# Altium schematic sheet CFD.SchDoc: CFD
size A3; Author: M.Beldyga; CompanyName: WUT ISE; DrawnBy: M.Beldyga; Organization: WUT ISE; Address1: PW ISE; Address2: Nowowiejska 15/19 00-665 Warsaw; Address3: micbeldyga@gmail.com; SheetNumber: 2; SheetTotal: 3; ModifiedBy: -; CheckedDate: -; Title2: MODULIQ; DivGrp: WUT ISE; Designer: M.Beldyga; ModifiedDate: -; ProjectName: Sensor Box
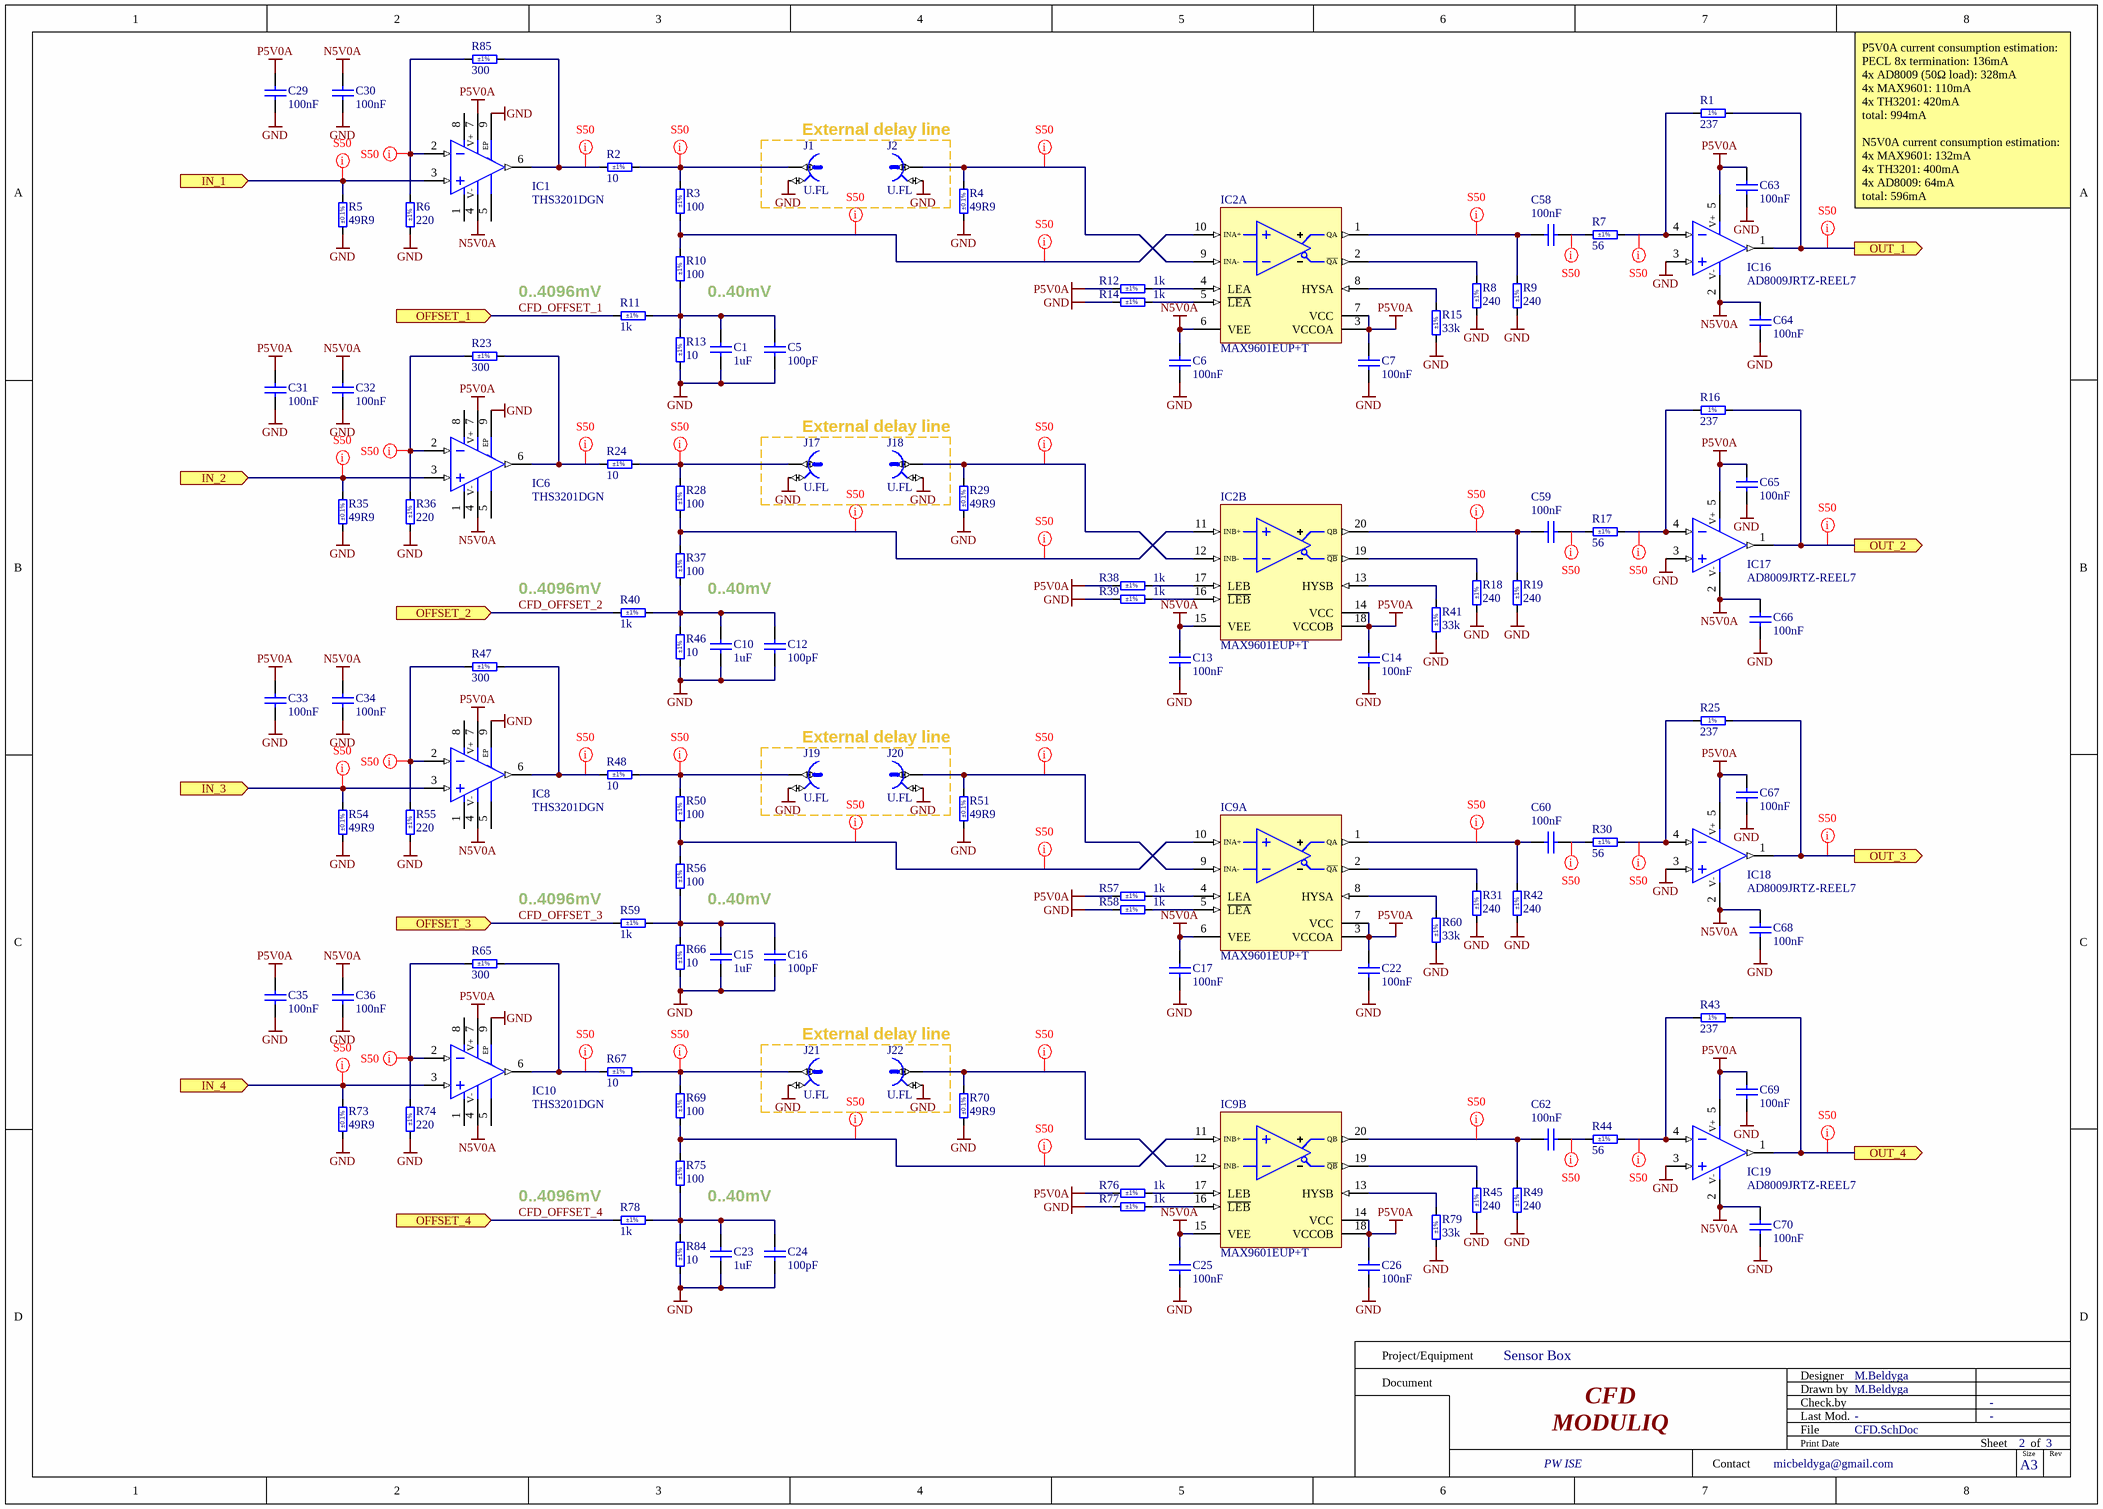
[diagram p0: CFD.SchDoc]

## Parts
C1  1uF  [CAPC1005X55N]
C5  100pF  [CAPC1005X55N]
C6  100nF  [CAPC1005X55N]
C7  100nF  [CAPC1005X55N]
C10  1uF  [CAPC1005X55N]
C12  100pF  [CAPC1005X55N]
C13  100nF  [CAPC1005X55N]
C14  100nF  [CAPC1005X55N]
C15  1uF  [CAPC1005X55N]
C16  100pF  [CAPC1005X55N]
C17  100nF  [CAPC1005X55N]
C22  100nF  [CAPC1005X55N]
C23  1uF  [CAPC1005X55N]
C24  100pF  [CAPC1005X55N]
C25  100nF  [CAPC1005X55N]
C26  100nF  [CAPC1005X55N]
C29  100nF  [CAPC1005X55N]
C30  100nF  [CAPC1005X55N]
C31  100nF  [CAPC1005X55N]
C32  100nF  [CAPC1005X55N]
C33  100nF  [CAPC1005X55N]
C34  100nF  [CAPC1005X55N]
C35  100nF  [CAPC1005X55N]
C36  100nF  [CAPC1005X55N]
C58  100nF  [CAPC1005X55N]
C59  100nF  [CAPC1005X55N]
C60  100nF  [CAPC1005X55N]
C62  100nF  [CAPC1005X55N]
C63  100nF  [CAPC1005X55N]
C64  100nF  [CAPC1005X55N]
C65  100nF  [CAPC1005X55N]
C66  100nF  [CAPC1005X55N]
C67  100nF  [CAPC1005X55N]
C68  100nF  [CAPC1005X55N]
C69  100nF  [CAPC1005X55N]
C70  100nF  [CAPC1005X55N]
IC1  THS3201DGN  [SOP65P490X110-9N-R152X190]
IC2  MAX9601EUP+T  [SOP65P640X120-20N]  (parts A,B of 2)
IC6  THS3201DGN  [SOP65P490X110-9N-R152X190]
IC8  THS3201DGN  [SOP65P490X110-9N-R152X190]
IC9  MAX9601EUP+T  [SOP65P640X120-20N]  (parts A,B of 2)
IC10  THS3201DGN  [SOP65P490X110-9N-R152X190]
IC16  AD8009JRTZ-REEL7  [SOT95P280X145-5N]
IC17  AD8009JRTZ-REEL7  [SOT95P280X145-5N]
IC18  AD8009JRTZ-REEL7  [SOT95P280X145-5N]
IC19  AD8009JRTZ-REEL7  [SOT95P280X145-5N]
J1  U.FL  [HIROSE_U.FL-R-SMT-1]
J2  U.FL  [HIROSE_U.FL-R-SMT-1]
J17  U.FL  [HIROSE_U.FL-R-SMT-1]
J18  U.FL  [HIROSE_U.FL-R-SMT-1]
J19  U.FL  [HIROSE_U.FL-R-SMT-1]
J20  U.FL  [HIROSE_U.FL-R-SMT-1]
J21  U.FL  [HIROSE_U.FL-R-SMT-1]
J22  U.FL  [HIROSE_U.FL-R-SMT-1]
R1  237  [RESC1005X40N]
R2  10  Tolerance: ±1%  [RESC1005X40N]
R3  100  Tolerance: ±1%  [RESC1005X40N]
R4  49R9  Tolerance: ±0.1%  [RESC2012X60N]
R5  49R9  Tolerance: ±0.1%  [RESC2012X60N]
R6  220  Tolerance: ±1%  [RESC1005X40N]
R7  56  Tolerance: ±1%  [RESC1005X40N]
R8  240  Tolerance: ±1%  [RESC1608X55N]
R9  240  Tolerance: ±1%  [RESC1608X55N]
R10  100  Tolerance: ±1%  [RESC1005X40N]
R11  1k  Tolerance: ±1%  [RESC1005X40N]
R12  1k  Tolerance: ±1%  [RESC1005X40N]
R13  10  Tolerance: ±1%  [RESC1005X40N]
R14  1k  Tolerance: ±1%  [RESC1005X40N]
R15  33k  Tolerance: ±1%  [RESC1005X40N]
R16  237  [RESC1005X40N]
R17  56  Tolerance: ±1%  [RESC1005X40N]
R18  240  Tolerance: ±1%  [RESC1608X55N]
R19  240  Tolerance: ±1%  [RESC1608X55N]
R23  300  Tolerance: ±1%  [RESC1005X40N]
R24  10  Tolerance: ±1%  [RESC1005X40N]
R25  237  [RESC1005X40N]
R28  100  Tolerance: ±1%  [RESC1005X40N]
R29  49R9  Tolerance: ±0.1%  [RESC2012X60N]
R30  56  Tolerance: ±1%  [RESC1005X40N]
R31  240  Tolerance: ±1%  [RESC1608X55N]
R35  49R9  Tolerance: ±0.1%  [RESC2012X60N]
R36  220  Tolerance: ±1%  [RESC1005X40N]
R37  100  Tolerance: ±1%  [RESC1005X40N]
R38  1k  Tolerance: ±1%  [RESC1005X40N]
R39  1k  Tolerance: ±1%  [RESC1005X40N]
R40  1k  Tolerance: ±1%  [RESC1005X40N]
R41  33k  Tolerance: ±1%  [RESC1005X40N]
R42  240  Tolerance: ±1%  [RESC1608X55N]
R43  237  [RESC1005X40N]
R44  56  Tolerance: ±1%  [RESC1005X40N]
R45  240  Tolerance: ±1%  [RESC1608X55N]
R46  10  Tolerance: ±1%  [RESC1005X40N]
R47  300  Tolerance: ±1%  [RESC1005X40N]
R48  10  Tolerance: ±1%  [RESC1005X40N]
R49  240  Tolerance: ±1%  [RESC1608X55N]
R50  100  Tolerance: ±1%  [RESC1005X40N]
R51  49R9  Tolerance: ±0.1%  [RESC2012X60N]
R54  49R9  Tolerance: ±0.1%  [RESC2012X60N]
R55  220  Tolerance: ±1%  [RESC1005X40N]
R56  100  Tolerance: ±1%  [RESC1005X40N]
R57  1k  Tolerance: ±1%  [RESC1005X40N]
R58  1k  Tolerance: ±1%  [RESC1005X40N]
R59  1k  Tolerance: ±1%  [RESC1005X40N]
R60  33k  Tolerance: ±1%  [RESC1005X40N]
R65  300  Tolerance: ±1%  [RESC1005X40N]
R66  10  Tolerance: ±1%  [RESC1005X40N]
R67  10  Tolerance: ±1%  [RESC1005X40N]
R69  100  Tolerance: ±1%  [RESC1005X40N]
R70  49R9  Tolerance: ±0.1%  [RESC2012X60N]
R73  49R9  Tolerance: ±0.1%  [RESC2012X60N]
R74  220  Tolerance: ±1%  [RESC1005X40N]
R75  100  Tolerance: ±1%  [RESC1005X40N]
R76  1k  Tolerance: ±1%  [RESC1005X40N]
R77  1k  Tolerance: ±1%  [RESC1005X40N]
R78  1k  Tolerance: ±1%  [RESC1005X40N]
R79  33k  Tolerance: ±1%  [RESC1005X40N]
R84  10  Tolerance: ±1%  [RESC1005X40N]
R85  300  Tolerance: ±1%  [RESC1005X40N]

## Blocks framed on the sheet
External delay line: J1 J2
External delay line: J17 J18
External delay line: J19 J20
External delay line: J21 J22

## Ports
IN_1 (in), IN_2 (in), IN_3 (in), IN_4 (in), OFFSET_1 (in), OFFSET_2 (in), OFFSET_3 (in), OFFSET_4 (in), OUT_1 (out), OUT_2 (out), OUT_3 (out), OUT_4 (out)

## Nets
GND: C1.1 C5.1 C6.1 C7.1 C10.1 C12.1 C13.1 C14.1 C15.1 C16.1 C17.1 C22.1 C23.1 C24.1 C25.1 C26.1 C29.1 C30.1 C31.1 C32.1 C33.1 C34.1 C35.1 C36.1 C63.1 C64.1 C65.1 C66.1 C67.1 C68.1 C69.1 C70.1 IC1.9(EP) IC6.9(EP) IC8.9(EP) IC10.9(EP) IC16.3(IN+) IC17.3(IN+) IC18.3(IN+) IC19.3(IN+) J1.2 J2.2 J17.2 J18.2 J19.2 J20.2 J21.2 J22.2 R4.1 R5.1 R6.1 R8.1 R9.1 R13.1 R14.2 R15.1 R18.1 R19.1 R29.1 R31.1 R35.1 R36.1 R39.2 R41.1 R42.1 R45.1 R46.1 R49.1 R51.1 R54.1 R55.1 R58.2 R60.1 R66.1 R70.1 R73.1 R74.1 R77.2 R79.1 R84.1
N5V0A: C6.2 C13.2 C17.2 C25.2 C30.2 C32.2 C34.2 C36.2 C64.2 C66.2 C68.2 C70.2 IC1.4(V-) IC2.6(VEE) IC2.15(VEE) IC6.4(V-) IC8.4(V-) IC9.6(VEE) IC9.15(VEE) IC10.4(V-) IC16.2(V-) IC17.2(V-) IC18.2(V-) IC19.2(V-)
P5V0A: C7.2 C14.2 C22.2 C26.2 C29.2 C31.2 C33.2 C35.2 C63.2 C65.2 C67.2 C69.2 IC1.7(V+) IC2.3(VCCOA) IC2.7(VCC) IC2.14(VCC) IC2.18(VCCOB) IC6.7(V+) IC8.7(V+) IC9.3(VCCOA) IC9.7(VCC) IC9.14(VCC) IC9.18(VCCOB) IC10.7(V+) IC16.5(V+) IC17.5(V+) IC18.5(V+) IC19.5(V+) R12.2 R38.2 R57.2 R76.2
CFD_OFFSET_1: R11.1 ; port OFFSET_1
CFD_OFFSET_2: R40.1 ; port OFFSET_2
CFD_OFFSET_3: R59.1 ; port OFFSET_3
CFD_OFFSET_4: R78.1 ; port OFFSET_4
IN_1: IC1.3(IN+) R5.2 ; port IN_1
IN_2: IC6.3(IN+) R35.2 ; port IN_2
IN_3: IC8.3(IN+) R54.2 ; port IN_3
IN_4: IC10.3(IN+) R73.2 ; port IN_4
OUT_1: IC16.1(OUT) R1.2 ; port OUT_1
OUT_2: IC17.1(OUT) R16.2 ; port OUT_2
OUT_3: IC18.1(OUT) R25.2 ; port OUT_3
OUT_4: IC19.1(OUT) R43.2 ; port OUT_4
NetC1_2: C1.2 C5.2 R10.1 R11.2 R13.2
NetC10_2: C10.2 C12.2 R37.1 R40.2 R46.2
NetC15_2: C15.2 C16.2 R56.1 R59.2 R66.2
NetC23_2: C23.2 C24.2 R75.1 R78.2 R84.2
NetC58_1: C58.1 R7.1
NetC58_2: C58.2 IC2.1(QA) R9.2
NetC59_1: C59.1 R17.1
NetC59_2: C59.2 IC2.20(QB) R19.2
NetC60_1: C60.1 R30.1
NetC60_2: C60.2 IC9.1(QA) R42.2
NetC62_1: C62.1 R44.1
NetC62_2: C62.2 IC9.20(QB) R49.2
NetIC1_2: IC1.2(IN-) R6.2 R85.1
NetIC1_6: IC1.6(OUT) R2.1 R85.2
NetIC2_2: IC2.2(~{QA}) R8.2
NetIC2_4: IC2.4(LEA) R12.1
NetIC2_5: IC2.5(~{LEA}) R14.1
NetIC2_8: IC2.8(HYSA) R15.2
NetIC2_9: IC2.9(INA-) J2.1 R4.2
NetIC2_10: IC2.10(INA+) R3.1 R10.2
NetIC2_11: IC2.11(INB+) R28.1 R37.2
NetIC2_12: IC2.12(INB-) J18.1 R29.2
NetIC2_13: IC2.13(HYSB) R41.2
NetIC2_16: IC2.16(~{LEB}) R39.1
NetIC2_17: IC2.17(LEB) R38.1
NetIC2_19: IC2.19(~{QB}) R18.2
NetIC6_2: IC6.2(IN-) R23.1 R36.2
NetIC6_6: IC6.6(OUT) R23.2 R24.1
NetIC8_2: IC8.2(IN-) R47.1 R55.2
NetIC8_6: IC8.6(OUT) R47.2 R48.1
NetIC9_2: IC9.2(~{QA}) R31.2
NetIC9_4: IC9.4(LEA) R57.1
NetIC9_5: IC9.5(~{LEA}) R58.1
NetIC9_8: IC9.8(HYSA) R60.2
NetIC9_9: IC9.9(INA-) J20.1 R51.2
NetIC9_10: IC9.10(INA+) R50.1 R56.2
NetIC9_11: IC9.11(INB+) R69.1 R75.2
NetIC9_12: IC9.12(INB-) J22.1 R70.2
NetIC9_13: IC9.13(HYSB) R79.2
NetIC9_16: IC9.16(~{LEB}) R77.1
NetIC9_17: IC9.17(LEB) R76.1
NetIC9_19: IC9.19(~{QB}) R45.2
NetIC10_2: IC10.2(IN-) R65.1 R74.2
NetIC10_6: IC10.6(OUT) R65.2 R67.1
NetIC16_4: IC16.4(IN-) R1.1 R7.2
NetIC17_4: IC17.4(IN-) R16.1 R17.2
NetIC18_4: IC18.4(IN-) R25.1 R30.2
NetIC19_4: IC19.4(IN-) R43.1 R44.2
NetJ1_1: J1.1 R2.2 R3.2
NetJ17_1: J17.1 R24.2 R28.2
NetJ19_1: J19.1 R48.2 R50.2
NetJ21_1: J21.1 R67.2 R69.2

Not connected (* = marked no-connect by the designer): IC1 1(NC) 5(NC) 8(NC); IC6 1(NC) 5(NC) 8(NC); IC8 1(NC) 5(NC) 8(NC); IC10 1(NC) 5(NC) 8(NC)

## Layout directives
net class S50: IN_1, IN_2, IN_3, IN_4, NetC58_1, NetC58_2, NetC59_1, NetC59_2, NetC60_1, NetC60_2, NetC62_1, NetC62_2, NetIC1_2, NetIC1_6, NetIC2_9, NetIC2_10, NetIC2_11, NetIC2_12, NetIC6_2, NetIC6_6, NetIC8_2, NetIC8_6, NetIC9_9, NetIC9_10, NetIC9_11, NetIC9_12, NetIC10_2, NetIC10_6, NetIC16_4, NetIC17_4, NetIC18_4, NetIC19_4, NetJ1_1, NetJ17_1, NetJ19_1, NetJ21_1, OUT_1, OUT_2, OUT_3, OUT_4

## Notes on the sheet
- P5V0A current consumption estimation:
  PECL 8x termination: 136mA
  4x AD8009 (50Ω load): 328mA
  4x MAX9601: 110mA
  4x TH3201: 420mA
  total: 994mA
  N5V0A current consumption estimation:
  4x MAX9601: 132mA
  4x TH3201: 400mA
  4x AD8009: 64mA
  total: 596mA
- (near R11) 0..4096mV
- 0..40mV
- (near R40) 0..4096mV
- (near R59) 0..4096mV
- (near R78) 0..4096mV
- Project/Equipment
- Document
- Designer
- Drawn by
- Check.by
- Contact
- File
- Last Mod.
- Print Date
- Sheet
- Size
- A3
- of
- Rev

## Library data of the parts
C1 C10 C15 C23 = CC0402_1UF_16V_10%_X5R: Non-polarised capacitor; Part Description: SMD Multilayer Chip Ceramic Capacitor; Manufacturer: GENERIC; Manufacturer1 Part Number: C1005X5R1C105KT; Voltage: 16V; TC: X5R; Tolerance: ±10%; Part Number: CC0402_1UF_16V_10%_X5R; Component Kind: Standard; Component Type: Standard; Pin Count: 2; Value: 1uF; Status: Preferred; Manufacturer Part Number: CC0402_1UF_16V_10%_X5R; Case: 0402; Mounted: Yes; Socket: No; SMD: Yes; Sense: No; Manufacturer1 Example: TDK; Manufacturer1 ComponentHeight: 0.55mm; HelpURL: \\cern.ch\dfs\Applications\Altium\Datasheets\CC0402_X5R_TDK_C.pdf; Author: CERN DEM JLC; CreateDate: 10/25/2012; LatestRevisionDate: 10/25/2012
C5 C12 C16 C24 = CC0402_100PF_25V_1%_C0G: Non-polarised capacitor; Part Description: SMD Multilayer Chip Ceramic Capacitor; Manufacturer: GENERIC; Manufacturer1 Part Number: CBR04C101F3GAC; Voltage: 25V; TC: C0G/NP0; Tolerance: ±1%; Part Number: CC0402_100PF_25V_1%_C0G; Component Kind: Standard; Component Type: Standard; Pin Count: 2; Value: 100pF; Status: Not Recommended; Manufacturer Part Number: CC0402_100PF_25V_1%_C0G; Case: 0402; Mounted: Yes; Socket: No; SMD: Yes; Sense: No; Manufacturer1 Example: KEMET; Manufacturer1 ComponentHeight: 0.55mm; HelpURL: \\cern.ch\dfs\Applications\Altium\Datasheets\CC0402_C0G_KEMET_HiQ-CBR.pdf; Author: CERN DEM HF; CreateDate: 10/20/2022; LatestRevisionDate: 10/20/2022
C6 C7 C13 C14 C17 C22 C25 C26 C29-C36 C58-C60 C62-C70 = CC0402_100NF_50V_10%_X7R: Non-polarised capacitor; Part Description: SMD Multilayer Chip Ceramic Capacitor; Manufacturer: GENERIC; Manufacturer1 Part Number: GRM155R71H104KE14D; Voltage: 50V; TC: X7R; Tolerance: ±10%; Part Number: CC0402_100NF_50V_10%_X7R; Component Kind: Standard; Component Type: Standard; Pin Count: 2; Value: 100nF; Status: None; Manufacturer Part Number: CC0402_100NF_50V_10%_X7R; Case: 0402; Mounted: Yes; Socket: No; SMD: Yes; Sense: No; Manufacturer1 Example: MURATA; Manufacturer1 ComponentHeight: 0.55mm; HelpURL: \\cern.ch\dfs\Applications\Altium\Datasheets\CC0402_MURATA_GRM155R71H104KE14D.pdf; Author: CERN DEM MR; CreateDate: 6/30/2017; LatestRevisionDate: 6/30/2017
IC1 IC6 IC8 IC10 = THS3201DGN: Operational Amplifier with Exposed Thermal Pad; Part Description: 1.8GHz, Low Distorsion, Current-Feedback Amplifier; Manufacturer: TEXAS INSTRUMENTS; PressFit: No; Bonding: No; Part Number: THS3201DGN; Component Kind: Standard; Component Type: Standard; Device: THS3201DGN; PackageDescription: SOP, 0.65mm Pitch; 8 Pin, 3.00mm W X 3.00mm L X 1.10mm H body (w/Thermal Tab 1.52 X 1.90 mm), IPC Medium Density; Manufacturer Part Number: THS3201DGN; Pin Count: 9; Case: MSOP8; Mounted: Yes; Socket: No; SMD: Yes; Sense: No; ComponentHeight: 1.1mm; Author: CERN DEM JLC; HelpURL: \\cern.ch\dfs\Applications\Altium\Datasheets\THS3201DGN.pdf; CreateDate: 6/16/2011; LatestRevisionDate: 6/16/2011
IC2 IC9 = MAX9601EUP+T: Dual ECL and Dual/Quad PECL, 500ps, Ultra-High-Speed Comparators; Manufacturer: Analog Devices; Manufacturer Lifecycle Status: PRODUCTION; Common Mode Rejection Ratio: 65dB; Hysteresis: 30mV; Input Bias Current: 6µA; Input Offset Voltage (Vos): 5mV; Max Power Dissipation: 879mW; Number of Channels: 2; Output Current: 50mA; Quiescent Current: 27mA; Supplier: DigiKey; Supplier Part Number: MAX9601EUP+TCT-ND; Manufacturer Part Number: MAX9601EUP+T; RoHS: Compliant; Category: Comparators; Stock: 1903; Pricing: 1=17.41, 10=13.831, 25=12.938, 100=11.9557, 250=11.48748, 500=11.20534 (USD); Case/Package: TSSOP; Contact Plating: Tin; Lead Free: Lead Free; Lifecycle Status: Production; Max Operating Temperature: 85°C; Min Operating Temperature: -40°C; Mounting Technology: Surface Mount; Number of Elements: 2; Pins: 20; Propagation Delay: 500ps; Radiation Hardening: No; ComponentLink1URL: https://octopart.com:443/opatz8j6/c1?t=PFuOBUjDsw3wpuId7RXVynjlz92aH7NlWikQNjXJpaEIuLxcLwZAi4Ti0_sWmo3bu2DBDIhNuf5qwDtOXYdOG0lWn8FP227O2rNdpRJGpc96HN9OKwH7QRwuPtbGiDHREB6CIL9KnMjTDUIHEhjD70VgABJ5WcMqw_V7Uu9lcWnamnKqVDW21ubSmt8Vyruz0d_OAM182zkvHGdCYP3fv_j11Y96AbY-09Hz6ELj8tweAj2wsNj6ZkWOmaily4xdV4FfF2zIYA7V1VNEBfZBTfRt7_tn0sbVyLBuIvR7l23CMqEDxJzTi3Qy&src-supplier=Analog+Devices; ComponentLink1Description: https://octopart.com:443/opatz8j6/c1?t=PFuOBUjDsw3wpuId7RXVynjlz92aH7NlWikQNjXJpaEIuLxcLwZAi4Ti0_sWmo3bu2DBDIhNuf5qwDtOXYdOG0lWn8FP227O2rNdpRJGpc96HN9OKwH7QRwuPtbGiDHREB6CIL9KnMjTDUIHEhjD70VgABJ5WcMqw_V7Uu9lcWnamnKqVDW21ubSmt8Vyruz0d_OAM182zkvHGdCYP3fv_j11Y96AbY-09Hz6ELj8tweAj2wsNj6ZkWOmaily4xdV4FfF2zIYA7V1VNEBfZBTfRt7_tn0sbVyLBuIvR7l23CMqEDxJzTi3Qy&src-supplier=Analog+Devices; ComponentLink2URL: https://datasheet.octopart.com:443/MAX9601EUP%2BT-Analog-Devices-datasheet-7471.pdf?src-supplier=SHENGYU+ELECTRONICS; ComponentLink2Description: https://datasheet.octopart.com:443/MAX9601EUP%2BT-Analog-Devices-datasheet-7471.pdf?src-supplier=SHENGYU+ELECTRONICS; ComponentLink3URL: https://datasheet.octopart.com:443/MAX9601EUP%2BT-Maxim-Integrated-datasheet-15935780.pdf?src-supplier=iiiC; ComponentLink3Description: https://datasheet.octopart.com:443/MAX9601EUP%2BT-Maxim-Integrated-datasheet-15935780.pdf?src-supplier=iiiC; ComponentLink4URL: http://sigma.octopart.com:80/conflict_mineral_statement/Analog-Devices-company-33.pdf?src-supplier=Compliance+Statements; ComponentLink4Description: http://sigma.octopart.com:80/conflict_mineral_statement/Analog-Devices-company-33.pdf?src-supplier=Compliance+Statements; ComponentLink5URL: http://sigma.octopart.com:80/conflict_mineral_statement/Maxim-Integrated-company-65.pdf?src-supplier=Compliance+Statements; ComponentLink5Description: http://sigma.octopart.com:80/conflict_mineral_statement/Maxim-Integrated-company-65.pdf?src-supplier=Compliance+Statements; ComponentLink6URL: http://sigma.octopart.com:80/rohs_statement/Maxim-Integrated-company-66.pdf?src-supplier=Compliance+Statements; ComponentLink6Description: http://sigma.octopart.com:80/rohs_statement/Maxim-Integrated-company-66.pdf?src-supplier=Compliance+Statements; ComponentLink7URL: http://sigma.octopart.com:80/reach_statement/Maxim-Integrated-company-67.pdf?src-supplier=Compliance+Statements; ComponentLink7Description: http://sigma.octopart.com:80/reach_statement/Maxim-Integrated-company-67.pdf?src-supplier=Compliance+Statements; ComponentLink8URL: https://octopart.com:443/opatz8j6/c1?t=d85wYbqPlJhHSQfXAPUDKq4lKhmUu3NuNL9mv1qgBSpVdKtrmKxS-3tJPowOJql-O4rd4C1xnetHto7pcLpBwo7dA199RGlO5Ddq0Nxi-gCvceWx7EpQI6tGnxNJpJXZNdCIoguqCdvipGVn16MDOWqe_Kb_ICcap6Lywz76z5rQsKVI62dfXhDAKaEOp5WQzUOIFbjI6nmqyAUIYjLLCVtYIBM_v_nkKwh0C577aFm2GYg2UMuMIl_RoWGr0OGswk5OmkdPaRlDe6QHJAJp0PnpLP1oPfec_CxtcPI86-jCXlCsqNrInZRJ&src-supplier=Compliance+Statements; ComponentLink8Description: https://octopart.com:443/opatz8j6/c1?t=d85wYbqPlJhHSQfXAPUDKq4lKhmUu3NuNL9mv1qgBSpVdKtrmKxS-3tJPowOJql-O4rd4C1xnetHto7pcLpBwo7dA199RGlO5Ddq0Nxi-gCvceWx7EpQI6tGnxNJpJXZNdCIoguqCdvipGVn16MDOWqe_Kb_ICcap6Lywz76z5rQsKVI62dfXhDAKaEOp5WQzUOIFbjI6nmqyAUIYjLLCVtYIBM_v_nkKwh0C577aFm2GYg2UMuMIl_RoWGr0OGswk5OmkdPaRlDe6QHJAJp0PnpLP1oPfec_CxtcPI86-jCXlCsqNrInZRJ&src-supplier=Compliance+Statements
IC16-IC19 = AD8009JRTZ-REEL7: Operational Amplifier; Part Description: 1GHz, 5,500 V/us Low Distortion Amplifier; Manufacturer: ANALOG DEVICES; PressFit: No; Bonding: No; Part Number: AD8009JRTZ-REEL7; Component Kind: Standard; Component Type: Standard; Device: AD8009JRTZ-REEL7; PackageDescription: SOT, 0.95mm Pitch; 5 Pin, 1.60mm W X 2.90mm L X 1.45mm H body, IPC Medium Density; Manufacturer Part Number: AD8009JRT; Pin Count: 5; Case: SOT23-5; Mounted: Yes; Socket: No; SMD: Yes; Sense: No; ComponentHeight: 1.45mm; Author: CERN DEM JLC; HelpURL: \\cern.ch\dfs\Applications\Altium\Datasheets\AD8009JRTZ-REEL7.pdf; CreateDate: 9/23/2010; LatestRevisionDate: 3/29/2022
J1 J2 J17-J22 = HIROSE_U.FL-R-SMT-1(10): Part Description: Up to 6GHz Ultra Small Surface Mount Male Coaxial Connectors U.FL Series; Manufacturer: HIROSE (HRS); PressFit: No; Part Number: HIROSE_U.FL-R-SMT-1(10); Component Kind: Standard; Component Type: Standard; Pin Count: 2; Family: U.FL; Mounted: Yes; Socket: No; SMD: Yes; Sense: No; Status: None; Manufacturer Part Number: U.FL-R-SMT-1; ComponentHeight: 1.25mm; HelpURL: \\cern.ch\dfs\Applications\Altium\Datasheets\HIROSE_U.FL-R-SMT-1.pdf; Author: CERN DEM JLC; CreateDate: 3/24/2010; LatestRevisionDate: 8/29/2024
R1 R16 R25 R43 = R0402_237R_1%_0.0625W: RES 237 OHM 1% 1/16W 0402; Manufacturer: GENERIC; Manufacturer 1: Yageo; Manufacturer 1 Part Number: RC0402FR-07237RL; Manufacturer 2 Part Number: RMCF0402FT237R; Manufacturer 3 Part Number: CRCW0402237RFKED; Part Number: R0402_237R_1%_0.0625W; Component Kind: Standard; Component Type: Standard; Pin Count: 2; Value: 237; Power: 0.0625W; Tolerance: 1%; Manufacturer Part Number: R0402_237R_1%_0.0625W; Case: 0402; Status: Active; Manufacturer 2: Stackpole Electronics; Manufacturer 3: Vishay Dale; Author: Michal Beldyga; CreateDate: 9/16/2024; LastRevision: 9/16/2024
R2 R13 R24 R46 R48 R66 R67 R84 = R0402_10R_1%_0.0625W_200PPM: Resistor - 1%; Part Description: General Purpose Thick Film Chip Resistor; Manufacturer: GENERIC; Manufacturer1 Part Number: 232270671009L; TC: ±200ppm/°C; PressFit: No; Part Number: R0402_10R_1%_0.0625W_200PPM; Component Kind: Standard; Component Type: Standard; Pin Count: 2; Value: 10; Status: Not Recommended; Power: 0.0625W; Manufacturer Part Number: R0402_10R_1%_0.0625W_200PPM; Case: 0402; Mounted: Yes; Sense: No; Socket: No; SMD: Yes; Manufacturer1 Example: YAGEO PHYCOMP; Manufacturer1 ComponentHeight: 0.4mm; HelpURL: \\cern.ch\dfs\Applications\Altium\Datasheets\R0402_Phycomp_RC0402.pdf; Author: CERN DEM JLC; CreateDate: 6/24/2009; LatestRevisionDate: 10/17/2012
R3 R10 R28 R37 R50 R56 R69 R75 = R0402_100R_1%_0.0625W_100PPM: Resistor - 1%; Part Description: General Purpose Thick Film Chip Resistor; Manufacturer: GENERIC; Manufacturer1 Part Number: 232270671001L; TC: ±100ppm/°C; PressFit: No; Part Number: R0402_100R_1%_0.0625W_100PPM; Component Kind: Standard; Component Type: Standard; Pin Count: 2; Value: 100; Status: Not Recommended; Power: 0.0625W; Manufacturer Part Number: R0402_100R_1%_0.0625W_100PPM; Case: 0402; Mounted: Yes; Sense: No; Socket: No; SMD: Yes; Manufacturer1 Example: YAGEO PHYCOMP; Manufacturer1 ComponentHeight: 0.4mm; HelpURL: \\cern.ch\dfs\Applications\Altium\Datasheets\R0402_Phycomp_RC0402.pdf; Author: CERN DEM JLC; CreateDate: 12/3/2007; LatestRevisionDate: 10/17/2012
R4 R5 R29 R35 R51 R54 R70 R73 = R0805_49R9_0.1%_0.1W_10PPM: Resistor - 0.1%; Part Description: Thin Film Chip Resistor; Manufacturer: GENERIC; Manufacturer1 Part Number: RN73C2A49R9BTG; Power: 0.1W; TC: ±10ppm; PressFit: No; Part Number: R0805_49R9_0.1%_0.1W_10PPM; Component Kind: Standard; Component Type: Standard; Pin Count: 2; Value: 49R9; Status: Not Recommended; Manufacturer Part Number: R0805_49R9_0.1%_0.1W_10PPM; Case: 0805; Mounted: Yes; Sense: No; Socket: No; SMD: Yes; Manufacturer1 Example: TYCO HOLSWORTHY; Manufacturer1 ComponentHeight: 0.6mm; HelpURL: \\cern.ch\dfs\Applications\Altium\Datasheets\R0805_Tyco_RN73.pdf; Author: CERN DEM JLC; CreateDate: 12/3/2007; LatestRevisionDate: 3/13/2008
R6 R36 R55 R74 = R0402_220R_1%_0.0625W_100PPM: Resistor - 1%; Part Description: General Purpose Thick Film Chip Resistor; Manufacturer: GENERIC; Manufacturer1 Part Number: 232270672201L; TC: ±100ppm/°C; PressFit: No; Part Number: R0402_220R_1%_0.0625W_100PPM; Component Kind: Standard; Component Type: Standard; Pin Count: 2; Value: 220; Status: Not Recommended; Power: 0.0625W; Manufacturer Part Number: R0402_220R_1%_0.0625W_100PPM; Case: 0402; Mounted: Yes; Sense: No; Socket: No; SMD: Yes; Manufacturer1 Example: YAGEO PHYCOMP; Manufacturer1 ComponentHeight: 0.4mm; HelpURL: \\cern.ch\dfs\Applications\Altium\Datasheets\R0402_Phycomp_RC0402.pdf; Author: CERN DEM JLC; CreateDate: 12/3/2007; LatestRevisionDate: 10/17/2012
R7 R17 R30 R44 = R0402_56R_1%_0.0625W_100PPM: Resistor - 1%; Part Description: General Purpose Thick Film Chip Resistor; Manufacturer: GENERIC; Manufacturer1 Part Number: 232270675609L; TC: ±100ppm/°C; PressFit: No; Part Number: R0402_56R_1%_0.0625W_100PPM; Component Kind: Standard; Component Type: Standard; Pin Count: 2; Value: 56; Status: Not Recommended; Power: 0.0625W; Manufacturer Part Number: R0402_56R_1%_0.0625W_100PPM; Case: 0402; Mounted: Yes; Sense: No; Socket: No; SMD: Yes; Manufacturer1 Example: YAGEO PHYCOMP; Manufacturer1 ComponentHeight: 0.4mm; HelpURL: \\cern.ch\dfs\Applications\Altium\Datasheets\R0402_Phycomp_RC0402.pdf; Author: CERN DEM JLC; CreateDate: 12/3/2007; LatestRevisionDate: 10/17/2012
R8 R9 R18 R19 R31 R42 R45 R49 = R0603_240R_1%_0.1W_100PPM: Resistor - 1%; Part Description: General Purpose Thick Film Chip Resistor; Manufacturer: GENERIC; Manufacturer1 Part Number: NRC06F2400TRF; Power: 0.1W; TC: ±100ppm/°C; PressFit: No; Part Number: R0603_240R_1%_0.1W_100PPM; Component Kind: Standard; Component Type: Standard; Pin Count: 2; Value: 240; Status: Preferred; Manufacturer Part Number: R0603_240R_1%_0.1W_100PPM; Case: 0603; Mounted: Yes; Sense: No; Socket: No; SMD: Yes; Manufacturer1 Example: NIC COMPONENT; Manufacturer1 ComponentHeight: 0.55mm; HelpURL: \\cern.ch\dfs\Applications\Altium\Datasheets\R0603_NIC_NRC.pdf; Author: CERN DEM JLC; CreateDate: 12/3/2007; LatestRevisionDate: 3/13/2008
R11 R12 R14 R38-R40 R57-R59 R76-R78 = R0402_1K_1%_0.0625W_100PPM: Resistor - 1%; Part Description: General Purpose Thick Film Chip Resistor; Manufacturer: GENERIC; Manufacturer1 Part Number: 232270671002L; TC: ±100ppm/°C; PressFit: No; Part Number: R0402_1K_1%_0.0625W_100PPM; Component Kind: Standard; Component Type: Standard; Pin Count: 2; Value: 1k; Status: Not Recommended; Power: 0.0625W; Manufacturer Part Number: R0402_1K_1%_0.0625W_100PPM; Case: 0402; Mounted: Yes; Sense: No; Socket: No; SMD: Yes; Manufacturer1 Example: YAGEO PHYCOMP; Manufacturer1 ComponentHeight: 0.4mm; HelpURL: \\cern.ch\dfs\Applications\Altium\Datasheets\R0402_Phycomp_RC0402.pdf; Author: CERN DEM JLC; CreateDate: 12/3/2007; LatestRevisionDate: 10/17/2012
R15 R41 R60 R79 = R0402_33K_1%_0.0625W_100PPM: Resistor - 1%; Part Description: General Purpose Thick Film Chip Resistor; Manufacturer: GENERIC; Manufacturer1 Part Number: 232270673303L; TC: ±100ppm/°C; PressFit: No; Part Number: R0402_33K_1%_0.0625W_100PPM; Component Kind: Standard; Component Type: Standard; Pin Count: 2; Value: 33k; Status: Not Recommended; Power: 0.0625W; Manufacturer Part Number: R0402_33K_1%_0.0625W_100PPM; Case: 0402; Mounted: Yes; Sense: No; Socket: No; SMD: Yes; Manufacturer1 Example: YAGEO PHYCOMP; Manufacturer1 ComponentHeight: 0.4mm; HelpURL: \\cern.ch\dfs\Applications\Altium\Datasheets\R0402_Phycomp_RC0402.pdf; Author: CERN DEM JLC; CreateDate: 12/3/2007; LatestRevisionDate: 10/17/2012
R23 R47 R65 R85 = R0402_300R_1%_0.0625W_100PPM: Resistor - 1%; Part Description: General Purpose Thick Film Chip Resistor; Manufacturer: GENERIC; Manufacturer1 Part Number: 232270673001L; TC: ±100ppm/°C; PressFit: No; Part Number: R0402_300R_1%_0.0625W_100PPM; Component Kind: Standard; Component Type: Standard; Pin Count: 2; Value: 300; Status: Not Recommended; Power: 0.0625W; Manufacturer Part Number: R0402_300R_1%_0.0625W_100PPM; Case: 0402; Mounted: Yes; Sense: No; Socket: No; SMD: Yes; Manufacturer1 Example: YAGEO PHYCOMP; Manufacturer1 ComponentHeight: 0.4mm; HelpURL: \\cern.ch\dfs\Applications\Altium\Datasheets\R0402_Phycomp_RC0402.pdf; Author: CERN DEM JLC; CreateDate: 12/3/2007; LatestRevisionDate: 10/17/2012